# Altium schematic sheet ADCs.SchDoc
size A4; SheetNumber: 5; SheetTotal: 6; SPICEModelCacheMZQGRJLK: <root> / <DocumentId>MZQGRJLK</DocumentId> / <CacheFrame Number="0"> / <Model Name="0603_885012206052_1uf" Kind="CKT"> / <Text>******* / .subckt 0603_885012206052_1uF 1 2 / Rser 1 3 0.00742821402486 / Lser 2 4 2.51142993E-10 / C1 3 4 0.000001 / Rpar 3 4 100000000 / .ends 0603_885012206052_1uF</Text> / </Model> / <Model Name="0603_885012206071_100nf" Kind="CKT"> / <Text>******* / .subckt 0603_885012206071_100nF 1 2 / Rser 1 3 0.025 / Lser 2 4 0.0000000008 / C1 3 4 0.0000001 / Rpar 3 4 5000000000 / .ends 0603_885012206071_100nF</Text> / </Model> / </CacheFrame> / </root>
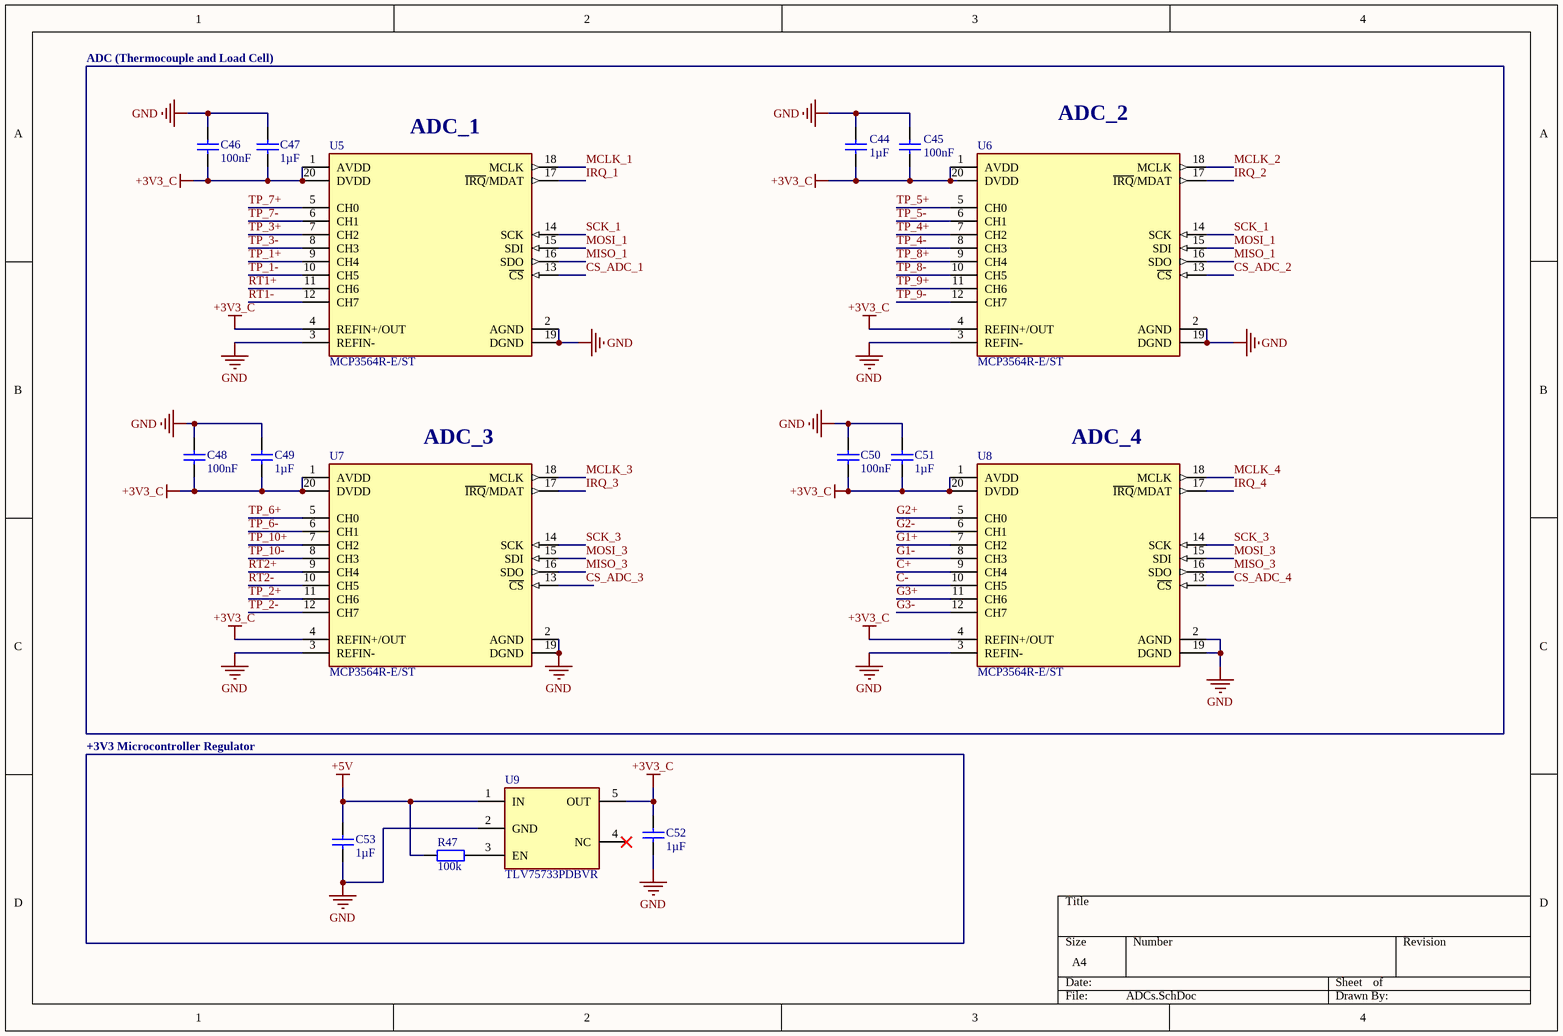
[diagram p0: ADCs.SchDoc]

## Parts
C44  value 1µF  [WCAP-CSGP_0603_L1.6W0.8H0.8_Reflow]  (hidden comment: 885012206052)
C45  value 100nF  [WCAP-CSGP_0603_L1.6W0.8H0.8_Reflow]  (hidden comment: 885012206071)
C46  value 100nF  [WCAP-CSGP_0603_L1.6W0.8H0.8_Reflow]  (hidden comment: 885012206071)
C47  value 1µF  [WCAP-CSGP_0603_L1.6W0.8H0.8_Reflow]  (hidden comment: 885012206052)
C48  value 100nF  [WCAP-CSGP_0603_L1.6W0.8H0.8_Reflow]  (hidden comment: 885012206071)
C49  value 1µF  [WCAP-CSGP_0603_L1.6W0.8H0.8_Reflow]  (hidden comment: 885012206052)
C50  value 100nF  [WCAP-CSGP_0603_L1.6W0.8H0.8_Reflow]  (hidden comment: 885012206071)
C51  value 1µF  [WCAP-CSGP_0603_L1.6W0.8H0.8_Reflow]  (hidden comment: 885012206052)
C52  value 1µF  [WCAP-CSGP_0603_L1.6W0.8H0.8_Reflow]  (hidden comment: 885012206052)
C53  value 1µF  [WCAP-CSGP_0603_L1.6W0.8H0.8_Reflow]  (hidden comment: 885012206052)
R47  value 100k  [WRIS-RSKS_0603_Reflow]  (hidden comment: 560112116004)
U5  MCP3564R-E/ST  [FP-C04-088-MFG]
U6  MCP3564R-E/ST  [FP-C04-088-MFG]
U7  MCP3564R-E/ST  [FP-C04-088-MFG]
U8  MCP3564R-E/ST  [FP-C04-088-MFG]
U9  TLV75733PDBVR  [SOT95P280X145-5N]

## Blocks framed on the sheet
+3V3 Microcontroller Regulator: C52 C53 R47 U9

## Nets
+3V3_C: C44.2 C45.1 C46.2 C47.1 C48.2 C49.1 C50.2 C51.1 C52.2 U5.1(AVDD) U5.4(REFIN+/OUT) U5.20(DVDD) U6.1(AVDD) U6.4(REFIN+/OUT) U6.20(DVDD) U7.1(AVDD) U7.4(REFIN+/OUT) U7.20(DVDD) U8.1(AVDD) U8.4(REFIN+/OUT) U8.20(DVDD) U9.5(OUT)
+5V: C53.2 R47.1 U9.1(IN)
GND: C44.1 C45.2 C46.1 C47.2 C48.1 C49.2 C50.1 C51.2 C52.1 C53.1 U5.2(AGND) U5.3(REFIN-) U5.19(DGND) U6.2(AGND) U6.3(REFIN-) U6.19(DGND) U7.2(AGND) U7.3(REFIN-) U7.19(DGND) U8.2(AGND) U8.3(REFIN-) U8.19(DGND) U9.2(GND)
C+: U8.9(CH4)
C-: U8.10(CH5)
CS_ADC_1: U5.13(~{CS})
CS_ADC_2: U6.13(~{CS})
CS_ADC_3: U7.13(~{CS})
CS_ADC_4: U8.13(~{CS})
G1+: U8.7(CH2)
G1-: U8.8(CH3)
G2+: U8.5(CH0)
G2-: U8.6(CH1)
G3+: U8.11(CH6)
G3-: U8.12(CH7)
IRQ_1: U5.17(~{IRQ}/MDAT)
IRQ_2: U6.17(~{IRQ}/MDAT)
IRQ_3: U7.17(~{IRQ}/MDAT)
IRQ_4: U8.17(~{IRQ}/MDAT)
MCLK_1: U5.18(MCLK)
MCLK_2: U6.18(MCLK)
MCLK_3: U7.18(MCLK)
MCLK_4: U8.18(MCLK)
MISO_1: U5.16(SDO) U6.16(SDO)
MISO_3: U7.16(SDO) U8.16(SDO)
MOSI_1: U5.15(SDI) U6.15(SDI)
MOSI_3: U7.15(SDI) U8.15(SDI)
RT1+: U5.11(CH6)
RT1-: U5.12(CH7)
RT2+: U7.9(CH4)
RT2-: U7.10(CH5)
SCK_1: U5.14(SCK) U6.14(SCK)
SCK_3: U7.14(SCK) U8.14(SCK)
TP_1+: U5.9(CH4)
TP_1-: U5.10(CH5)
TP_2+: U7.11(CH6)
TP_2-: U7.12(CH7)
TP_3+: U5.7(CH2)
TP_3-: U5.8(CH3)
TP_4+: U6.7(CH2)
TP_4-: U6.8(CH3)
TP_5+: U6.5(CH0)
TP_5-: U6.6(CH1)
TP_6+: U7.5(CH0)
TP_6-: U7.6(CH1)
TP_7+: U5.5(CH0)
TP_7-: U5.6(CH1)
TP_8+: U6.9(CH4)
TP_8-: U6.10(CH5)
TP_9+: U6.11(CH6)
TP_9-: U6.12(CH7)
TP_10+: U7.7(CH2)
TP_10-: U7.8(CH3)
NetR47_2: R47.2 U9.3(EN)

Not connected (* = marked no-connect by the designer): U9 4(NC)*

## Notes on the sheet
- ADC (Thermocouple and Load Cell)
- (near U5) ADC_1
- (near U6) ADC_2
- (near U7) ADC_3
- (near U8) ADC_4

## Library data of the parts
C44 C47 C49 C51-C53 = CMP-001-00642-1: WCAP-CSGP Multilayer Ceramic Chip Capacitor, General Purpose, size 0603, X7R, 1uF, 16VDC; Manufacturer: Wurth Elektronik; Capacitance Tolerance: +/-10%; Insulation Resistance: 0.1GOhm; Rated Voltage (DC): 16V; Dissipation Factor: 10%; Technical Reference: X7R0603105K016DFCT10000; Component Type: Standard; Width: 0.8mm; Ceramic Type: X7R; ComponentLink1Description: Website Link; ComponentLink1URL: https://www.we-online.com/redexpert/article/885012206052?ad; Height: 0.8mm; Manufacturer Part Number: 885012206052; Match Code: WCAP-CSGP; Source: WCAP-CSGP.SchLib; Case/Package: 0603; Operating Temperature Min: -55°C; ComponentLink2Description: Datasheet Link; Design Item ID: 885012206052; ComponentLink2URL: https://www.we-online.com/redexpert/spec/885012206052?ad; Category: Multilayer Ceramic Chip Capacitors; Packaging: Tape and Reel; Pins: 2; Length: 1.6mm; Operating Temperature Max: 125°C; Mount: Surface Mount
C45 C46 C48 C50 = CMP-001-00661-1: WCAP-CSGP Multilayer Ceramic Chip Capacitor, General Purpose, size 0603, X7R, 100nF, 25VDC; Manufacturer: Wurth Elektronik; Dissipation Factor: 3.5%; Capacitance Tolerance: +/-10%; Insulation Resistance: 5GOhm; Technical Reference: X7R0603104K025DFCT10000; Rated Voltage (DC): 25V; Packaging: Tape and Reel; Height: 0.8mm; Mount: Surface Mount; Source: WCAP-CSGP.SchLib; Component Type: Standard; Category: Multilayer Ceramic Chip Capacitors; Operating Temperature Min: -55°C; Case/Package: 0603; ComponentLink2Description: Datasheet Link; Width: 0.8mm; ComponentLink1URL: https://www.we-online.com/redexpert/article/885012206071?ad; Length: 1.6mm; Operating Temperature Max: 125°C; Match Code: WCAP-CSGP; ComponentLink2URL: https://www.we-online.com/redexpert/spec/885012206071?ad; Design Item ID: 885012206071; ComponentLink1Description: Website Link; Manufacturer Part Number: 885012206071; Pins: 2; Ceramic Type: X7R
R47 = CMP-009-00327-1: WRIS-RSKS Thick Film Resistor, size 0603, 100000Ohm, 100mW; Manufacturer: Wurth Elektronik; Temperature Coefficient of Resistance Min: -100ppm/°C; Resistance Tolerance: +/-1%; Limiting Element Voltage: 75V; Temperature Coefficient of Resistance Max: 100ppm/°C; Height: 0.45mm; ComponentLink1URL: https://www.we-online.com/redexpert/article/560112116004?ad; Packaging: Tape and Reel; Match Code: WRIS-RSKS; Operating Temperature Max: 155°C; ComponentLink2Description: Datasheet Link; ComponentLink1Description: Website Link; Category: Thick Film Resistors; Operating Temperature Min: -55°C; Length: 1.6mm; Source: WRIS-RSKS.SchLib; Rated Power: 100mW; Mount: Surface Mount; Manufacturer Part Number: 560112116004; ComponentLink2URL: https://www.we-online.com/redexpert/spec/560112116004?ad; Component Type: Standard; Width: 0.8mm; Case/Package: 0603; Pins: 2; Design Item ID: 560112116004
U5-U8 = CMP-015-00000-1: ADC, Delta-Sigma, 24-Bit, 1 Func, 8 Channel, Serial Access, PDSO20; RoHS Compliant: Yes
U9 = CMP-087-000000-3: LDO Voltage Regulators 1A Low-IQ Small-Size Low-Dropout (LDO) Regulator 5-SOT-23 -40 to 125; Manufacturer: Texas Instruments; Manufacturer Part Number: TLV75733PDBVR